# Altium project mainPower.PrjPCB
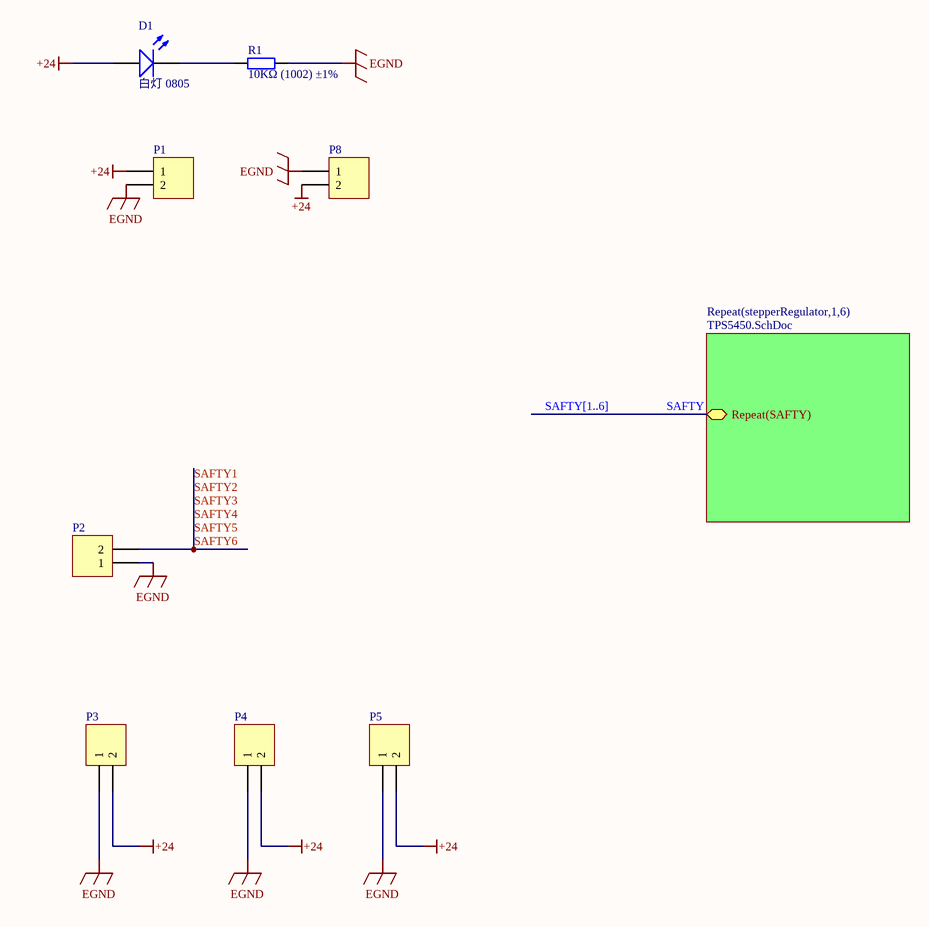
[diagram p0: mainPower.SchDoc]
2 sheets, 128 parts. Net scope: hierarchical (ports join the sheet entries above them; power ports are global).
Board file: stepperRegulator.PcbDoc
Sheets:
  mainPower.SchDoc
    stepperRegulator1 = TPS5450.SchDoc
    stepperRegulator2 = TPS5450.SchDoc
    stepperRegulator3 = TPS5450.SchDoc
    stepperRegulator4 = TPS5450.SchDoc
    stepperRegulator5 = TPS5450.SchDoc
    stepperRegulator6 = TPS5450.SchDoc

## Sheet mainPower.SchDoc
size A4

### Parts
D1  白灯 0805  [0805_LED_S1]
P1  Header 2  [5.08-2P]  (value not drawn)
P2  Header 2  [5.08-2P]  (value not drawn)
P3  Header 2  [XH-2A]  (value not drawn)
P4  Header 2  [XH-2A]  (value not drawn)
P5  Header 2  [XH-2A]  (value not drawn)
P8  Header 2  [5.08-2P]  (value not drawn)
R1  10KΩ (1002) ±1%  [0805_R]

### Sub-sheets
Repeat(stepperRegulator,1,6) = TPS5450.SchDoc: Repeat(SAFTY)

### Nets
+24: D1.A P1.1 P3.2 P4.2 P5.2 P8.2
EGND: P1.2 P2.1 P3.1 P4.1 P5.1 P8.1 R1.2
SAFTY: sheet Repeat(stepperRegulator,1,6)/Repeat(SAFTY)
SAFTY1: P2.2  [also labelled SAFTY2, SAFTY3, SAFTY4, SAFTY5, SAFTY6]  [project net SAFTY]
NetD1_K: D1.K R1.1

### Buses and harness runs
bus SAFTY[1..6]

### Library data of the parts
D1 = 0805 白灯: 发光二极管; ComponentLink1Description: 供应商链接; ComponentLink1URL: http://www.szlcsc.com/product/details_35468.html; Package: 0805; Supplier: LC; SuppliersPartNumber: C34499
P1-P5 P8 = Header 2: Header, 2-Pin; LatestRevisionDate: 17-Jul-2002; LatestRevisionNote: Re-released for DXP Platform.; Publisher: Altium Limited
R1 = 0805 10KΩ (1002) 1%: 贴片电阻; ComponentLink1Description: 供应商链接; ComponentLink1URL: http://www.szlcsc.com/product/details_18102.html; Package: 0805; Supplier: LC; SuppliersPartNumber: C17414

## Sheet TPS5450.SchDoc
size A4
Used 6 times, as channels stepperRegulator1, stepperRegulator2, stepperRegulator3, stepperRegulator4, stepperRegulator5, stepperRegulator6. Parts and nets are listed once, with the designators drawn on the sheet.
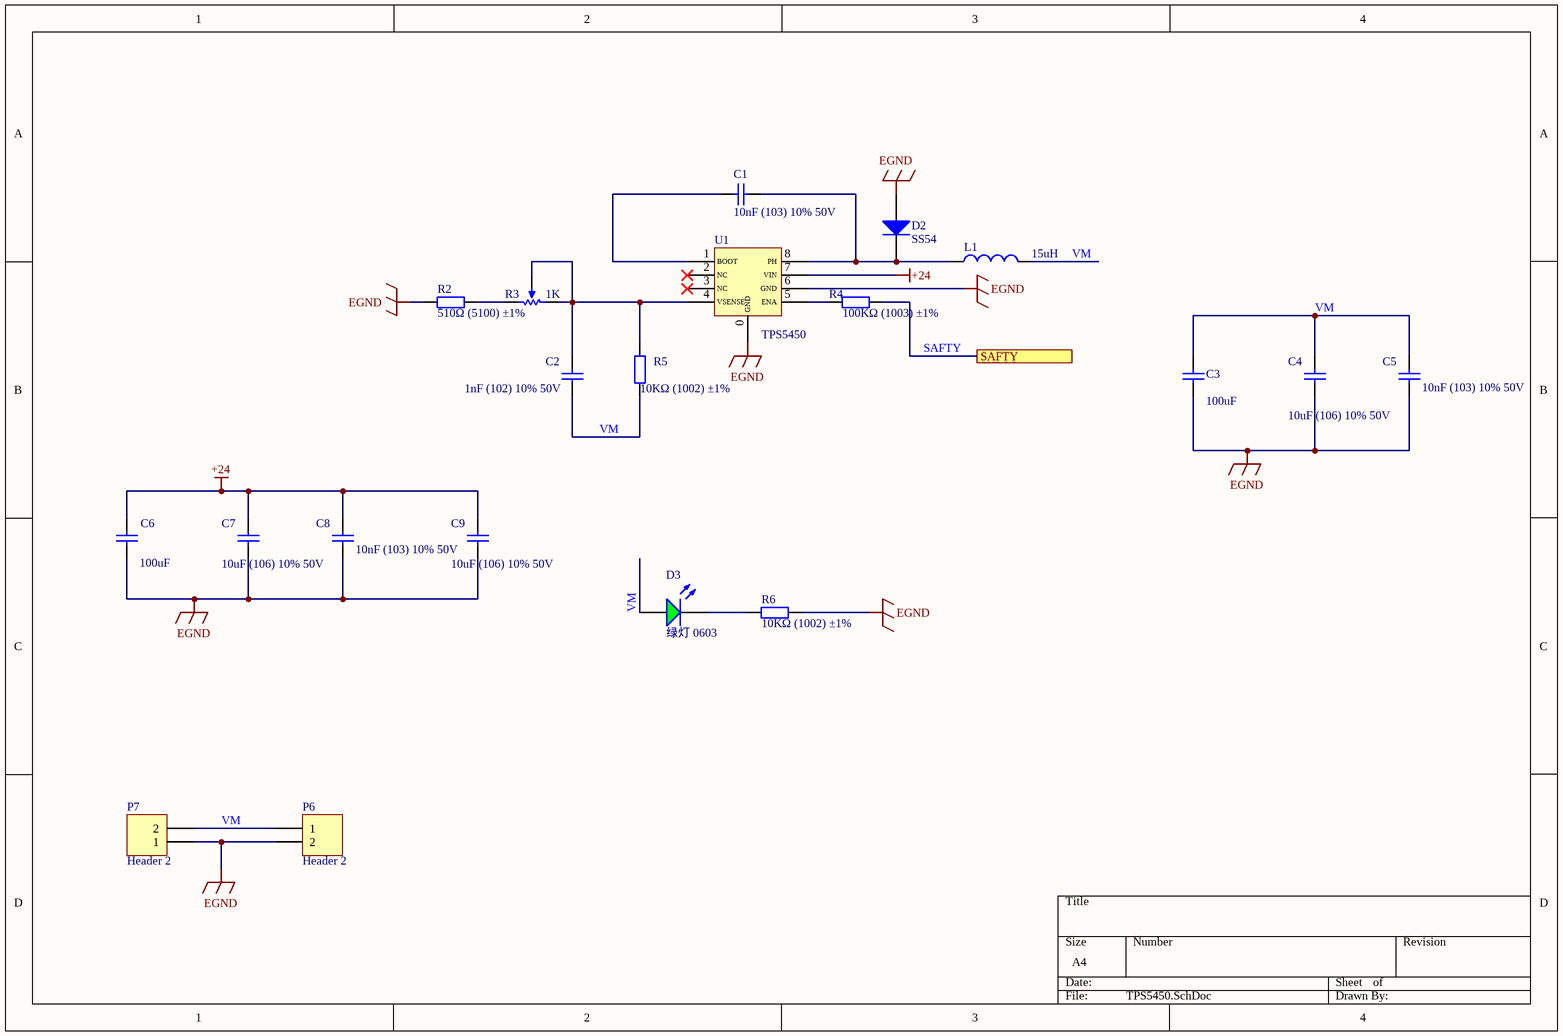
[diagram p1: TPS5450.SchDoc]

### Parts
C1  10nF (103) 10% 50V  [0603_C]
C2  1nF (102) 10% 50V  [0603_C]
C3  value 100uF  [C100uF]  (hidden comment: Cap)
C4  10uF (106) 10% 50V  [1206_C]
C5  10nF (103) 10% 50V  [0603_C]
C6  value 100uF  [C100uF]  (hidden comment: Cap)
C7  10uF (106) 10% 50V  [1206_C]
C8  10nF (103) 10% 50V  [0603_C]
C9  10uF (106) 10% 50V  [1206_C]
D2  SS54  [SMA(DO-214AC)_S1]
D3  绿灯 0603  [0603_LED_S1]
L1  value 15uH  [INDP175172X70M]  (hidden comment: Inductor)
P6  Header 2  [5.08-2P]
P7  Header 2  [XH-2A]
R2  510Ω (5100) ±1%  [0603_R]
R3  value 1K  [RP1]  (hidden comment: RPot)
R4  100KΩ (1003) ±1%  [0603_R]
R5  10KΩ (1002) ±1%  [0603_R]
R6  10KΩ (1002) ±1%  [0603_R]
U1  TPS5450  [LC-SOP-8_EP_150mil]

### Ports
SAFTY

### Nets
+24: C6.2 C7.2 C8.2 C9.2 U1.7(VIN)
EGND: C3.1 C4.1 C5.1 C6.1 C7.1 C8.1 C9.1 D2.1(A) P6.2 P7.1 R2.1 R6.2 U1.0(GND) U1.6(GND)
SAFTY: R4.2 ; port SAFTY
VM: C2.1 C3.2 C4.2 C5.2 D3.A L1.2 P6.1 P7.2 R5.1
NetC1_1: C1.1 U1.1(BOOT)
NetC1_2: C1.2 D2.2(K) L1.1 U1.8(PH)
NetC2_2: C2.2 R3.2(TAP) R3.3(BOT) R5.2 U1.4(VSENSE)
NetD3_K: D3.K R6.1
NetR2_2: R2.2 R3.1(TOP)
NetR4_1: R4.1 U1.5(ENA)

Not connected (* = marked no-connect by the designer): U1 2(NC)* 3(NC)*

### Channels
stepperRegulator1: designators end in _stepperRegulator1; ports SAFTY=SAFTY
stepperRegulator2: designators end in _stepperRegulator2; ports SAFTY=SAFTY
stepperRegulator3: designators end in _stepperRegulator3; ports SAFTY=SAFTY
stepperRegulator4: designators end in _stepperRegulator4; ports SAFTY=SAFTY
stepperRegulator5: designators end in _stepperRegulator5; ports SAFTY=SAFTY
stepperRegulator6: designators end in _stepperRegulator6; ports SAFTY=SAFTY

### Library data of the parts
C1 C5 C8 = 0603 10nF (103) 10% 50V: 贴片电容; ComponentLink1Description: 供应商链接; ComponentLink1URL: http://www.szlcsc.com/product/details_58143.html; Package: 0603; Supplier: LC; SuppliersPartNumber: C57112
C2 = 0603 1nF (102) 10% 50V: 贴片电容; ComponentLink1Description: 供应商链接; ComponentLink1URL: http://www.szlcsc.com/product/details_1940.html; Package: 0603; Supplier: LC; SuppliersPartNumber: C1588
C3 C6 = Cap: 贴片电容; Published: 8-Jun-2000; LatestRevisionDate: 17-Jul-2002; LatestRevisionNote: Re-released for DXP Platform.; PackageReference: RAD-0.3; Publisher: Altium Limited
C4 C7 C9 = 1206 10uF (106) 10% 50V: 贴片电容; ComponentLink1Description: 供应商链接; ComponentLink1URL: http://www.szlcsc.com/product/details_14236.html; Package: 1206; Supplier: LC; SuppliersPartNumber: C13585
D2 = SMA(DO-214AC) SS54: 二极管; ComponentLink1Description: 供应商链接; ComponentLink1URL: http://www.szlcsc.com/product/details_23178.html; Package: SMA(DO-214AC); Supplier: LC; SuppliersPartNumber: C22452
D3 = 0603 绿灯: 发光二极管; ComponentLink1Description: 供应商链接; ComponentLink1URL: http://www.szlcsc.com/product/details_73152.html; Package: 0603; Supplier: LC; SuppliersPartNumber: C72043
L1 = Inductor: Code_IEC: 1005; Published: 8-Jun-2000; LatestRevisionDate: 29-May-2009; LatestRevisionNote: IPC-7351 Footprint Added.; PackageReference: 0402-A; Publisher: Altium Limited; PackageDescription: Chip Inductor; Code_JEITA: 0402
P6 P7 = Header 2: Header, 2-Pin; LatestRevisionDate: 17-Jul-2002; LatestRevisionNote: Re-released for DXP Platform.; Publisher: Altium Limited
R2 = 0603 510Ω (5100) 1%: 贴片电阻; ComponentLink1Description: 供应商链接; ComponentLink1URL: http://www.szlcsc.com/product/details_23920.html; Package: 0603; Supplier: LC; SuppliersPartNumber: C23193
R3 = RPot: 电位器; Sim Note: Enter the Resistance value and the set point into parameter fields.; Set Position: 0.5; Published: 8-Jun-2000; LatestRevisionDate: 17-Jul-2002; LatestRevisionNote: Re-released for DXP Platform.; PackageReference: VR5; Publisher: Altium Limited
R4 = 0603 100KΩ (1003) 1%: 贴片电阻; ComponentLink1Description: 供应商链接; ComponentLink1URL: http://www.szlcsc.com/product/details_26546.html; Package: 0603; Supplier: LC; SuppliersPartNumber: C25803
R5 R6 = 0603 10KΩ (1002) 1%: 贴片电阻; ComponentLink1Description: 供应商链接; ComponentLink1URL: http://www.szlcsc.com/product/details_26547.html; Package: 0603; Supplier: LC; SuppliersPartNumber: C25804

## Nets that join several sheets
+24: mainPower (6 pins), stepperRegulator1 (5 pins), stepperRegulator2 (5 pins), stepperRegulator3 (5 pins), stepperRegulator4 (5 pins), stepperRegulator5 (5 pins), stepperRegulator6 (5 pins)
EGND: mainPower (7 pins), stepperRegulator1 (14 pins), stepperRegulator2 (14 pins), stepperRegulator3 (14 pins), stepperRegulator4 (14 pins), stepperRegulator5 (14 pins), stepperRegulator6 (14 pins)
SAFTY: mainPower (P2.2), stepperRegulator1 (R4_stepperRegulator1.2), stepperRegulator2 (R4_stepperRegulator2.2), stepperRegulator3 (R4_stepperRegulator3.2), stepperRegulator4 (R4_stepperRegulator4.2), stepperRegulator5 (R4_stepperRegulator5.2), stepperRegulator6 (R4_stepperRegulator6.2)